# Altium schematic sheet Plugs.SchDoc
size A4
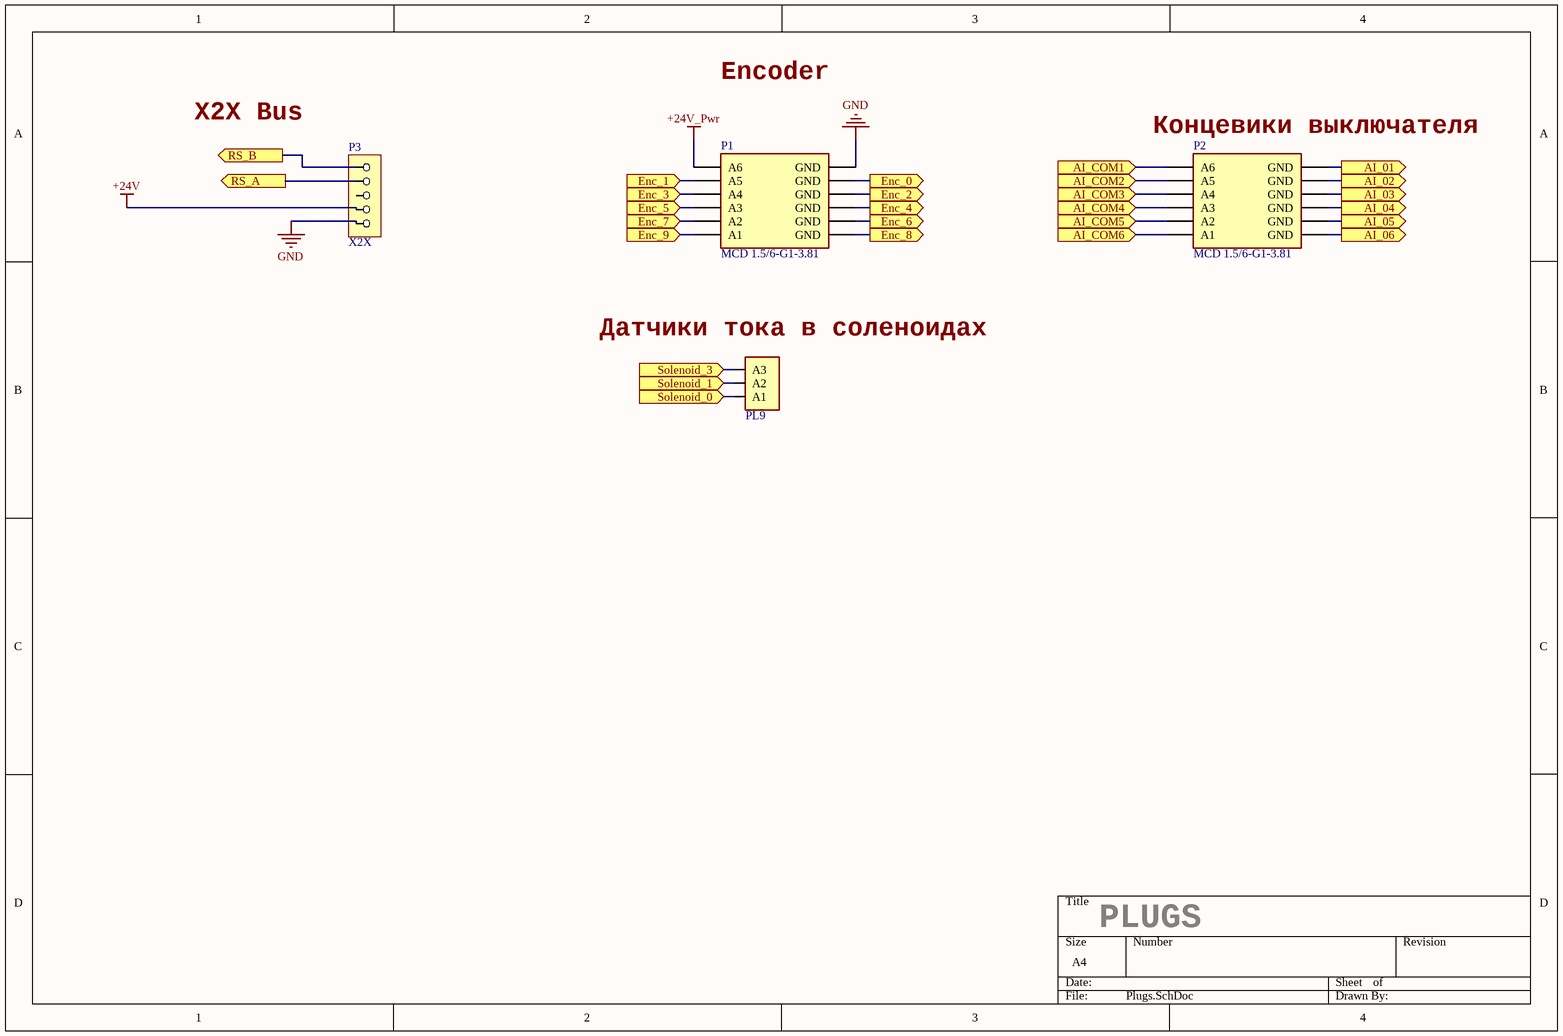
[diagram p0: Plugs.SchDoc]

## Parts
P1  MCD 1.5/6-G1-3.81  [mcd 1,5/6-G1-3.81]
P2  MCD 1.5/6-G1-3.81  [mcd 1,5/6-G1-3.81]
P3  X2X  [PhClass5]
PL9  Plug 3Pin  [3.81 Plug]  (value not drawn)

## Ports
AI_01, AI_02, AI_03, AI_04, AI_05, AI_06, AI_COM1, AI_COM2, AI_COM3, AI_COM4, AI_COM5, AI_COM6, Enc_0, Enc_1, Enc_2, Enc_3, Enc_4, Enc_5, Enc_6, Enc_7, Enc_8, Enc_9, RS_A, RS_B, Solenoid_0, Solenoid_1, Solenoid_3

## Nets
+24V: P3.4
+24V_Pwr: P1.1(A6)
GND: P1.2(GND) P3.5
AI_01: P2.2(GND) ; port AI_01
AI_02: P2.4(GND) ; port AI_02
AI_03: P2.6(GND) ; port AI_03
AI_04: P2.8(GND) ; port AI_04
AI_05: P2.10(GND) ; port AI_05
AI_06: P2.12(GND) ; port AI_06
AI_COM1: P2.1(A6) ; port AI_COM1
AI_COM2: P2.3(A5) ; port AI_COM2
AI_COM3: P2.5(A4) ; port AI_COM3
AI_COM4: P2.7(A3) ; port AI_COM4
AI_COM5: P2.9(A2) ; port AI_COM5
AI_COM6: P2.11(A1) ; port AI_COM6
Enc_0: P1.4(GND) ; port Enc_0
Enc_1: P1.3(A5) ; port Enc_1
Enc_2: P1.6(GND) ; port Enc_2
Enc_3: P1.5(A4) ; port Enc_3
Enc_4: P1.8(GND) ; port Enc_4
Enc_5: P1.7(A3) ; port Enc_5
Enc_6: P1.10(GND) ; port Enc_6
Enc_7: P1.9(A2) ; port Enc_7
Enc_8: P1.12(GND) ; port Enc_8
Enc_9: P1.11(A1) ; port Enc_9
RS_A: P3.2 ; port RS_A
RS_B: P3.1 ; port RS_B
Solenoid_0: PL9.1(A1) ; port Solenoid_0
Solenoid_1: PL9.2(A2) ; port Solenoid_1
Solenoid_3: PL9.3(A3) ; port Solenoid_3

Not connected (* = marked no-connect by the designer): P3 3

## Notes on the sheet
- Encoder
- X2X Bus
- (near P2) Концевики выключателя
- (near PL9) Датчики тока в соленоидах
- PLUGS

## Library data of the parts
P1 P2 = Header 6X2: Header, 6-Pin, Dual row; LatestRevisionDate: 17-Jul-2002; LatestRevisionNote: Re-released for DXP Platform.; Publisher: Altium Limited
P3 = EMSTBA 2.5/5-G-5.08
PL9 = Plug 3Pin: 15EDGRC-3.81-03P-14-00AH